# Altium schematic sheet ArduVape Power Schematics.SchDoc
size A
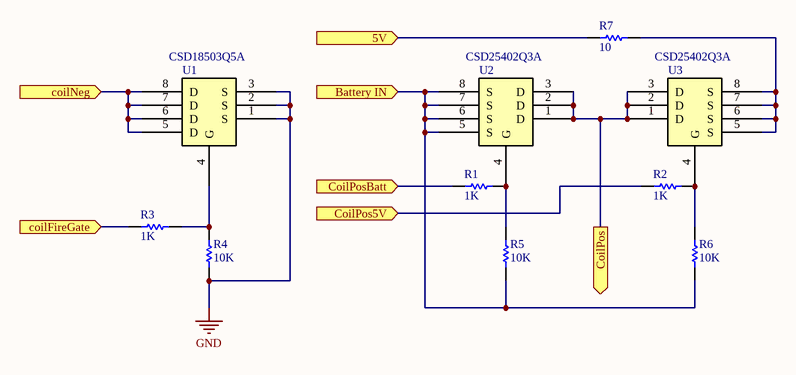
[diagram p0: ArduVape Power Schematics.SchDoc]

## Parts
R1  value 1K  [Res0805]  (hidden comment: 1K Ohm Resistor)
R2  value 1K  [Res0805]  (hidden comment: 1K Ohm Resistor)
R3  value 1K  [Res0805]  (hidden comment: 1K Ohm Resistor)
R4  value 10K  [res0805]  (hidden comment: 10K Ohm Resistor)
R5  value 10K  [res0805]  (hidden comment: 10K Ohm Resistor)
R6  value 10K  [res0805]  (hidden comment: 10K Ohm Resistor)
R7  value 10  [res0805]  (hidden comment: 10 Ohm Resistor)
U1  CSD18503Q5A  [SON 5mmx6mm]
U2  CSD25402Q3A  [SON 3.3 x 3.3]
U3  CSD25402Q3A  [SON 3.3 x 3.3]

## Ports
5V (in), Battery IN (in), coilFireGate (in), coilNeg (in), CoilPos5V (in), CoilPos (out), CoilPosBatt (in)

## Nets
GND: R4.1 U1.1(S) U1.2(S) U1.3(S)
5V: R7.2 ; port 5V
Battery IN: R5.1 R6.1 U2.5(S) U2.6(S) U2.7(S) U2.8(S) ; port Battery IN
coilFireGate: R3.2 ; port coilFireGate
coilNeg: U1.5(D) U1.6(D) U1.7(D) U1.8(D) ; port coilNeg
CoilPos: U2.1(D) U2.2(D) U2.3(D) U3.1(D) U3.2(D) U3.3(D) ; port CoilPos
CoilPos5V: R2.2 ; port CoilPos5V
CoilPosBatt: R1.2 ; port CoilPosBatt
NetR1_1: R1.1 R5.2 U2.4(G)
NetR2_1: R2.1 R6.2 U3.4(G)
NetR3_1: R3.1 R4.2 U1.4(G)
NetR7_1: R7.1 U3.5(S) U3.6(S) U3.7(S) U3.8(S)

## Library data of the parts
R1-R3 = 1K 0805: 1K Ohm Resistor 0805
R4-R6 = 10K 0805: 10K Ohm Resistor 0805
R7 = 10K 0805: 10 Ohm Resistor 0805
U1 = CSD18503Q5A: Power MOSFET 40V 100A; Vendor: TEXAS INSTRUMENTS; Manufacturer_Part_Number: CSD18503Q5A; RefDes: RefDes; Type: DEV; Value: Value
U2 U3 = CSD25402Q3A: –20 V P-Channel NexFET™ Power MOSFET